# EAGLE design INTERRUPTOR (EAGLE 9.5.2)
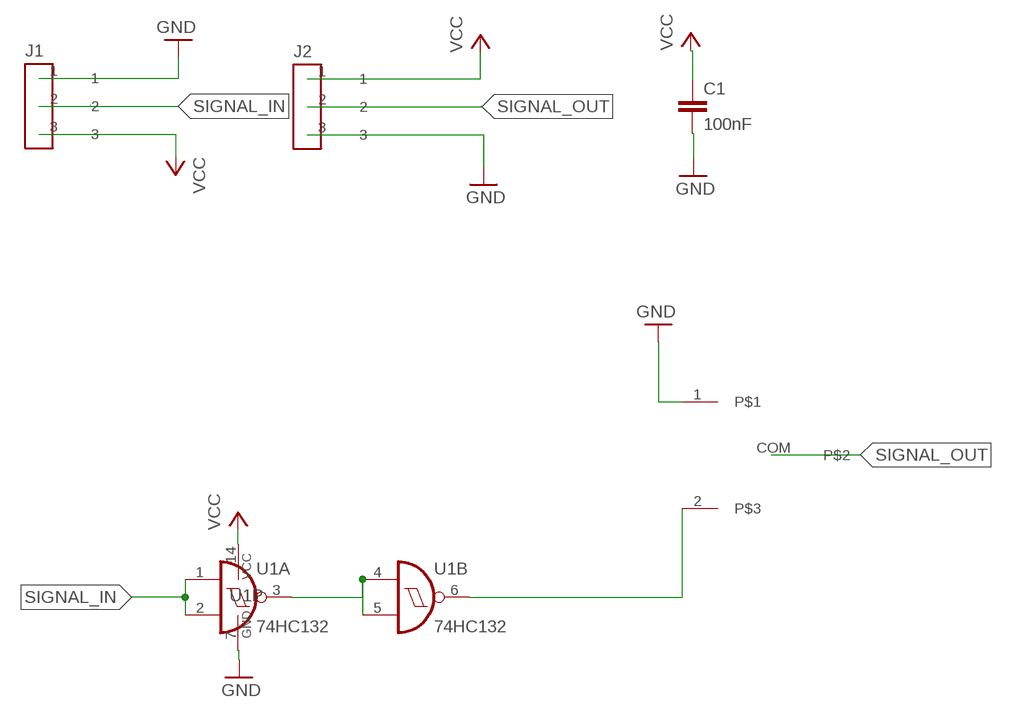
[diagram p0: schematic, sheet 1]

## Parts
C1  100nF  C-EUC0805  [C0805]
J1  CONECTOR_MACHO  [3CONECTOR]
J2  CONECTOR_FEMEA  [3CONECTOR]
J3  SS12F46  [SS12F46]
U1  74HC132  74HC132D  [SO14]

## Nets
GND: C1.2 J1.1 J2.3 J3.1 U1.7(P:GND)
N$2: U1.3(A:O) U1.4(B:I0) U1.5(B:I1)
N$3: J3.2 U1.6(B:O)
SIGNAL_IN: J1.2 U1.1(A:I0) U1.2(A:I1)
SIGNAL_OUT: J2.2 J3.COM
VCC: C1.1 J1.3 J2.1 U1.14(P:VCC)
Unconnected: U1.8(C:O) U1.9(C:I0) U1.10(C:I1) U1.11(D:O) U1.12(D:I0) U1.13(D:I1)

## Library data of the parts
C1 = rcl:C-EU: CAPACITOR, European symbol; SPICEPREFIX: C
J1 = Eletroblocks Lib:CONECTOR_MACHO
J2 = Eletroblocks Lib:CONECTOR_FEMEA
J3 = Eletroblocks Lib:SS12F46
U1 = 74xx-eu:74*132: Quad 2-input NAND schmitt trigger

## Board
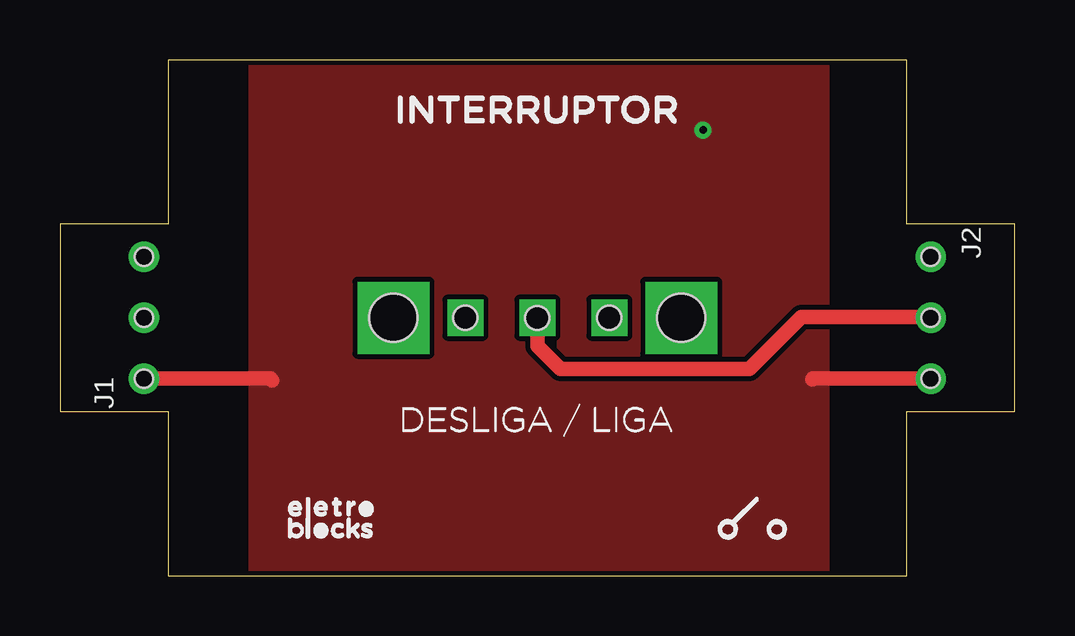
[diagram p1: board, top side]
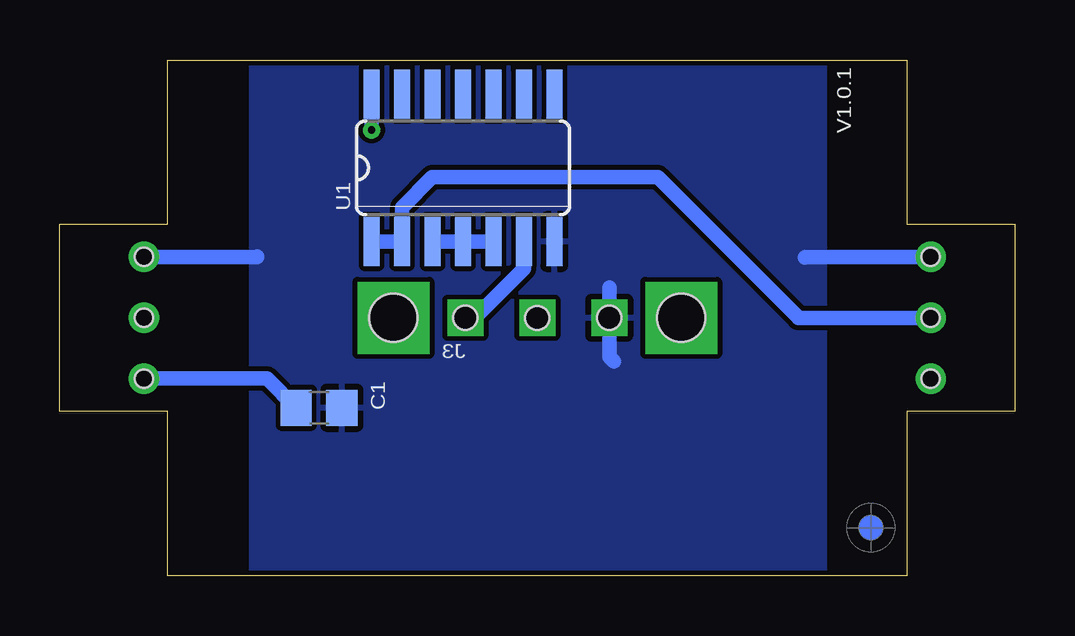
[diagram p2: board, bottom side, seen from below]

Size 39.8 x 21.5 mm. Coordinates in mm from the lower left corner, seen from the top.
Outline: 4.5,0 35.3,0 35.3,6.85 39.8,6.85 39.8,14.65 35.3,14.65 35.3,21.5 4.5,21.5 4.5,14.65 0,14.65 0,6.85 4.5,6.85 4.5,0
Copper layers (1*16): Top 0.035mm / dielectric 1.5mm / Bottom 0.035mm
Design rules "default *": minimum track width 6mil, minimum drill 0.35mm, track to track 8mil, track to pad 8mil, pad to pad 8mil, via to via 8mil, smd to smd 8mil, copper to edge 8mil, drill to drill 8mil, minimum pad ring 10mil, minimum via ring 8mil, stop-mask expansion 4mil, vias tented up to drill 0mil, thermal gap 10mil

### Footprints (pad centres in the part's own frame; a part is rotated, then mirrored left to right if it is on the bottom)
C0805 = smd 1.3 x 1.5: 1 -0.95,0; 2 0.95,0
3CONECTOR = drill 0.75: 1 0,2.54; 2 0,0; 3 0,-2.54 | hole 0.75: 0,2.54; 0,0; 0,-2.54
SS12F46 = drill 1 square: 1 -3,0; 2 3,0; COM 0,0 | drill 2 square: CON1 -6,0; CON2 6,0 | hole 1: 0,-0.01; -3,0; 3,0 | hole 2: -6,0; 6,0
SO14 = smd 0.66 x 2.032: 1 -3.81,-3.073; 2 -2.54,-3.073; 3 -1.27,-3.073; 4 0,-3.073; 5 1.27,-3.073; 6 2.54,-3.073; 7 3.81,-3.073; 8 3.81,3.073; 9 2.54,3.073; 10 1.27,3.073; 11 0,3.073; 12 -1.27,3.073; 13 -2.54,3.073; 14 -3.81,3.073

### Placement (x,y rotation side)
C1  29,7 0 bottom
J1  3.5,10.75 0 top
J2  36.3,10.75 180 top
J3  19.9,10.75 0 top
U1  23,17 0 bottom
U$2  [FIDUCIAL_G10]  6,2 0 bottom

### Tracks (layer width: path | path; a pad name or v marks a point on that pad's centre or on a via)
GND
  Bottom 0.61: J1.1 8.72,13.29 8.75,13.26 | J2.3 31.59,13.29 31.58,13.3 | 16.89,12.02 16.9,12.01 J3.1 16.9,9.11 16.71,8.93
  pour Bottom: 7.93,0 31.8,0 31.8,21.5 7.93,21.5
N$2
  Bottom 0.61: U1.3 U1.4 U1.5
N$3
  Bottom 0.61: U1.6 20.46,12.8 22.51,10.75 J3.2
SIGNAL_IN
  Bottom 0.61: J1.2 9.02,10.75 9.01,10.76 14.86,16.61 24.29,16.61 25.54,15.35 U1.2 U1.1
SIGNAL_OUT
  Top 0.61: J2.2 36.27,10.78 30.9,10.78 28.73,8.61 20.87,8.61 19.9,9.58 J3.COM
VCC  (via drill 0.3)
  Top 0.61: J1.3 8.79,8.21 8.85,8.14 | J2.1 31.39,8.21 31.36,8.18
  Bottom 0.61: U1.14 v26.81,18.58 | J2.1 31.16,8.21 C1.1
  pour Top: 8.07,0 8.07,21.19 7.93,21.34 31.79,21.34 31.86,21.26 31.86,0.07 31.93,0

### Text on the board
bPlace: V1.0.1